# EAGLE design version3 (EAGLE 6.6.0)
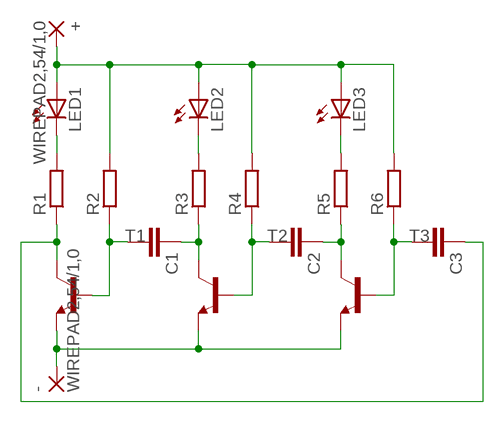
[diagram p0: schematic, sheet 1]

## Parts
+  WIREPAD2,54/1,0  [2,54/1,0]
-  WIREPAD2,54/1,0  [2,54/1,0]
C1  C-EUC0603  [C0603]
C2  C-EUC0603  [C0603]
C3  C-EUC0603  [C0603]
LED1  LEDSML0603  [SML0603]
LED2  LEDSML0603  [SML0603]
LED3  LEDSML0603  [SML0603]
R1  R-EU_R0603  [R0603]
R2  R-EU_R0603  [R0603]
R3  R-EU_R0603  [R0603]
R4  R-EU_R0603  [R0603]
R5  R-EU_R0603  [R0603]
R6  R-EU_R0603  [R0603]
T1  MMBT2222ALT1-NPN-SOT23-BEC  [SOT23-BEC]
T2  MMBT2222ALT1-NPN-SOT23-BEC  [SOT23-BEC]
T3  MMBT2222ALT1-NPN-SOT23-BEC  [SOT23-BEC]

## Nets
N$1: LED1.C R1.2
N$2: C3.1 R1.1 T1.C
N$3: C1.1 R3.1 T2.C
N$4: LED2.C R3.2
N$5: C2.2 R4.1 T2.B
N$6: C1.2 R2.1 T1.B
N$7: +.1(P) LED1.A LED2.A LED3.A R2.2 R4.2 R6.2
N$8: C2.1 R5.1 T3.C
N$9: -.1(P) T1.E T2.E T3.E
N$11: LED3.C R5.2
N$12: C3.2 R6.1 T3.B

## Library data of the parts
+ - = wirepad:WIREPAD: Wire PAD connect wire on PCB
C1-C3 = rcl:C-EU: CAPACITOR, European symbol
LED1-LED3 = led:LED: LED OSRAM: - CHIPLED LG R971, LG N971, LY N971, LG Q971, LY Q971, LO R971, LY R971 LH N974, LH R974 LS Q976, LO Q976, LY Q976 LO Q996 - Hyper CHIPLED LW Q18S LB Q993, LB Q99A, LB R99A - SideLED LS A670, LO A670, LY A670, LG A670, LP A670 LB A673, LV A673, LT A673, LW A673 LH A674 LY A675 LS A676, LA A676, LO A676, LY A676, LW A676 LS A679, LY A679, LG A679 - Hyper Micro SIDELED® LS Y876, LA Y876, LO Y876, LY Y876 LT Y87S - SmartLED LW L88C, LW L88S LB L89C, LB L89S, LG L890 LS L89K, LO L89K, LY L89K LS L896, LA L896, LO L896, LY L896 - TOPLED LS T670, LO T670, LY T670, LG T670, LP T670 LSG T670, LSP T670, LSY T670, LOP T670, LYG T670 LG T671, LOG T671, LSG T671 LB T673, LV T673, LT T673, LW T673 LH T674 LS T676, LA T676, LO T676, LY T676, LB T676, LH T676, LSB T676, LW T676 LB T67C, LV T67C, LT T67C, LS T67K, LO T67K, LY T67K, LW E67C LS E67B, LA E67B, LO E67B, LY E67B, LB E67C, LV E67C, LT E67C LW T67C LS T679, LY T679, LG T679 LS T770, LO T770, LY T770, LG T770, LP T770 LB T773, LV T773, LT T773, LW T773 LH T774 LS E675, LA E675, LY E675, LS T675 LS T776, LA T776, LO T776, LY T776, LB T776 LHGB T686 LT T68C, LB T68C - Hyper Mini TOPLED® LB M676 - Mini TOPLED Santana® LG M470 LS M47K, LO M47K, LY M47K Source: http://www.osram.convergy.de LUXEON: - LUMILED® LXK2-PW12-R00, LXK2-PW12-S00, LXK2-PW14-U00, LXK2-PW14-V00 LXK2-PM12-R00, LXK2-PM12-S00, LXK2-PM14-U00 LXK2-PE12-Q00, LXK2-PE12-R00, LXK2-PE12-S00, LXK2-PE14-T00, LXK2-PE14-U00 LXK2-PB12-K00, LXK2-PB12-L00, LXK2-PB12-M00, LXK2-PB14-N00, LXK2-PB14-P00, LXK2-PB14-Q00 LXK2-PR12-L00, LXK2-PR12-M00, LXK2-PR14-Q00, LXK2-PR14-R00 LXK2-PD12-Q00, LXK2-PD12-R00, LXK2-PD12-S00 LXK2-PH12-R00, LXK2-PH12-S00 LXK2-PL12-P00, LXK2-PL12-Q00, LXK2-PL12-R00 Source: www.luxeon.com KINGBRIGHT: KA-3528ASYC Source: www.kingbright.com
R1-R6 = rcl:R-EU_: RESISTOR, European symbol
T1-T3 = transistor-neu-to92:*-NPN-: NPN Transistror

## Board
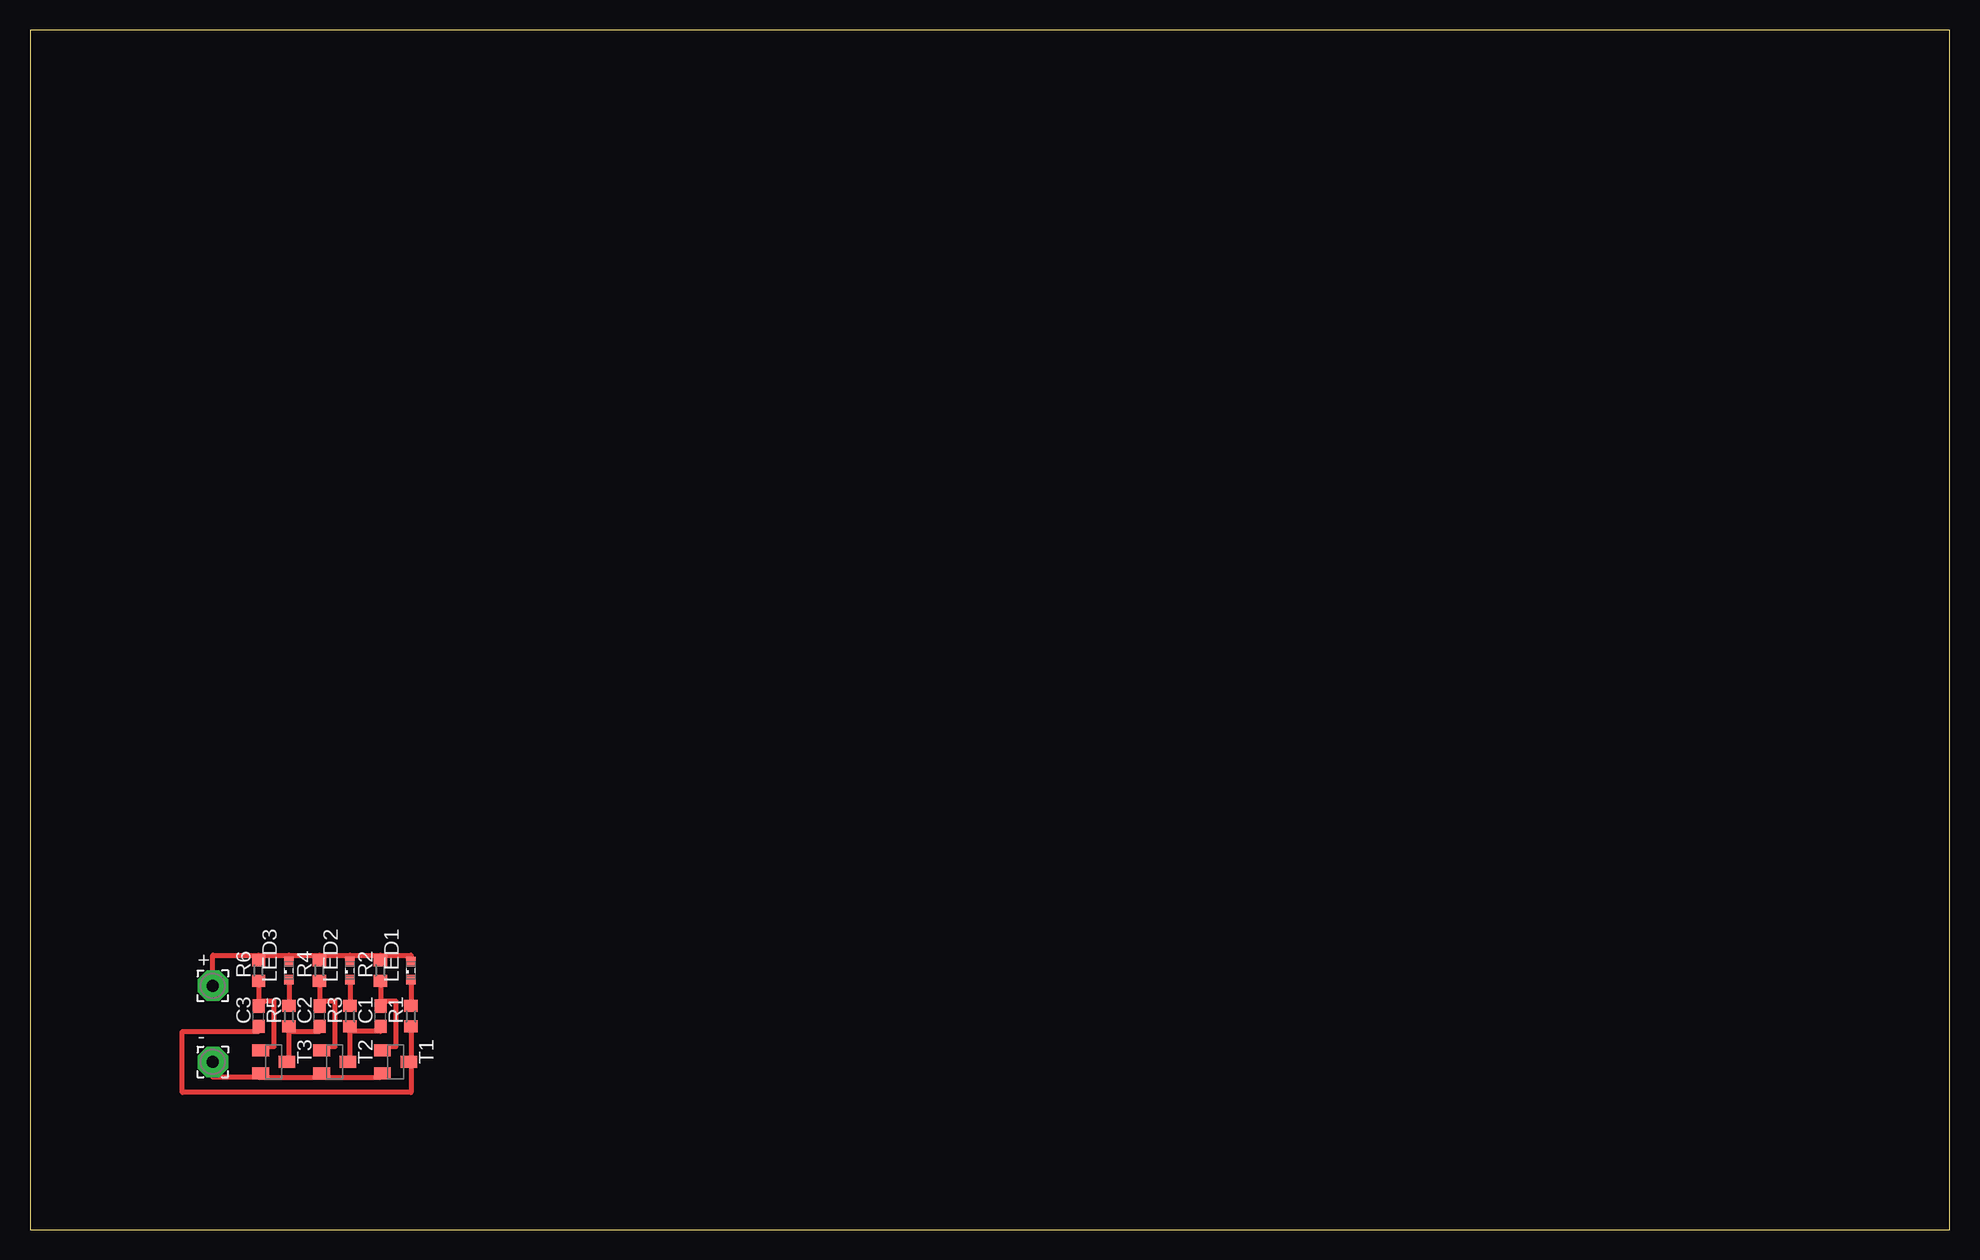
[diagram p1: board, top side]

Size 160 x 100 mm. Coordinates in mm from the lower left corner, seen from the top.
Outline: 0,0 160,0 160,100 0,100 0,0
Copper layers (1*16): Top 0.035mm / dielectric 1.5mm / Bottom 0.035mm
Design rules "default": minimum track width 10mil, minimum drill 24mil, track to track 8mil, track to pad 8mil, pad to pad 8mil, via to via 8mil, smd to smd 8mil, copper to edge 40mil, drill to drill 8mil, minimum pad ring 10mil, minimum via ring 8mil, stop-mask expansion 4mil, vias tented up to drill 0mil, thermal gap 10mil

### Footprints (pad centres in the part's own frame; a part is rotated, then mirrored left to right if it is on the bottom)
2,54/1,0 = drill 1.016 pad 2.54 octagon: 1 0,0
C0603 = smd 1.1 x 1: 1 -0.85,0; 2 0.85,0
SML0603 = smd 0.8 x 0.8: A 0.75,0; C -0.75,0
R0603 = smd 1 x 1.1: 1 -0.85,0; 2 0.85,0
SOT23-BEC = smd 1 x 1.4: B -0.95,-1.1; C 0,1.1; E 0.95,-1.1

### Placement (x,y rotation side)
+  15.24,20.32 0 top
-  15.24,13.97 0 top
C1  29.21,17.78 90 top
C2  24.13,17.78 90 top
C3  19.05,17.78 90 top
LED1  31.75,21.59 90 top
LED2  26.67,21.59 90 top
LED3  21.59,21.59 90 top
R1  31.75,17.78 90 top
R2  29.21,21.59 90 top
R3  26.67,17.78 90 top
R4  24.13,21.59 90 top
R5  21.59,17.78 90 top
R6  19.05,21.59 90 top
T1  30.48,13.97 270 top
T2  25.4,13.97 270 top
T3  20.32,13.97 270 top

### Tracks (layer width: path | path; a pad name or v marks a point on that pad's centre or on a via)
N$1
  Top 0.406: LED1.C R1.2
N$2
  Top 0.406: T1.C 31.75,13.97 | R1.1 31.75,13.97 | 31.75,13.97 31.75,11.43 12.7,11.43 12.7,16.51 19.05,16.51 C3.1
N$3
  Top 0.406: T2.C 26.67,13.97 26.67,16.51 | 26.67,16.51 R3.1 | C1.1 29.21,16.51 26.67,16.51
N$4
  Top 0.406: LED2.C R3.2
N$5
  Top 0.406: R4.1 24.13,19.05 | 24.13,19.05 25.4,19.05 25.4,15.24 24.3,15.24 T2.B | C2.2 24.13,19.05
N$6
  Top 0.406: R2.1 29.21,19.05 | 29.21,19.05 30.48,19.05 30.48,15.24 29.38,15.24 T1.B | C1.2 29.21,19.05
N$7
  Top 0.406: 19.05,22.86 21.59,22.86 | LED3.A 21.59,22.86 | 21.59,22.86 24.13,22.86 | R4.2 24.13,22.86 | 24.13,22.86 26.67,22.86 | LED2.A 26.67,22.86 | 26.67,22.86 29.21,22.86 | R2.2 29.21,22.86 | 29.21,22.86 31.75,22.86 LED1.A | +.1 15.24,22.86 19.05,22.86 | 19.05,22.86 R6.2
N$8
  Top 0.406: T3.C 21.59,13.97 21.59,16.51 | R5.1 21.59,16.51 | 21.59,16.51 24.13,16.51 C2.1
N$9
  Top 0.406: 19.05,12.7 24.13,12.7 | T1.E 29.21,13.02 29.21,12.7 24.13,12.7 | T2.E 24.13,13.02 24.13,12.7 | -.1 15.24,12.7 19.05,12.7 | T3.E 19.05,13.02 19.05,12.7
N$11
  Top 0.406: LED3.C R5.2
N$12
  Top 0.406: R6.1 19.05,19.05 | 19.05,19.05 20.32,19.05 20.32,15.24 19.22,15.24 T3.B | C3.2 19.05,19.05